# Altium schematic sheet BRZ_BATT_MGR.SchDoc
size B; SheetNumber: 1; SheetTotal: 9
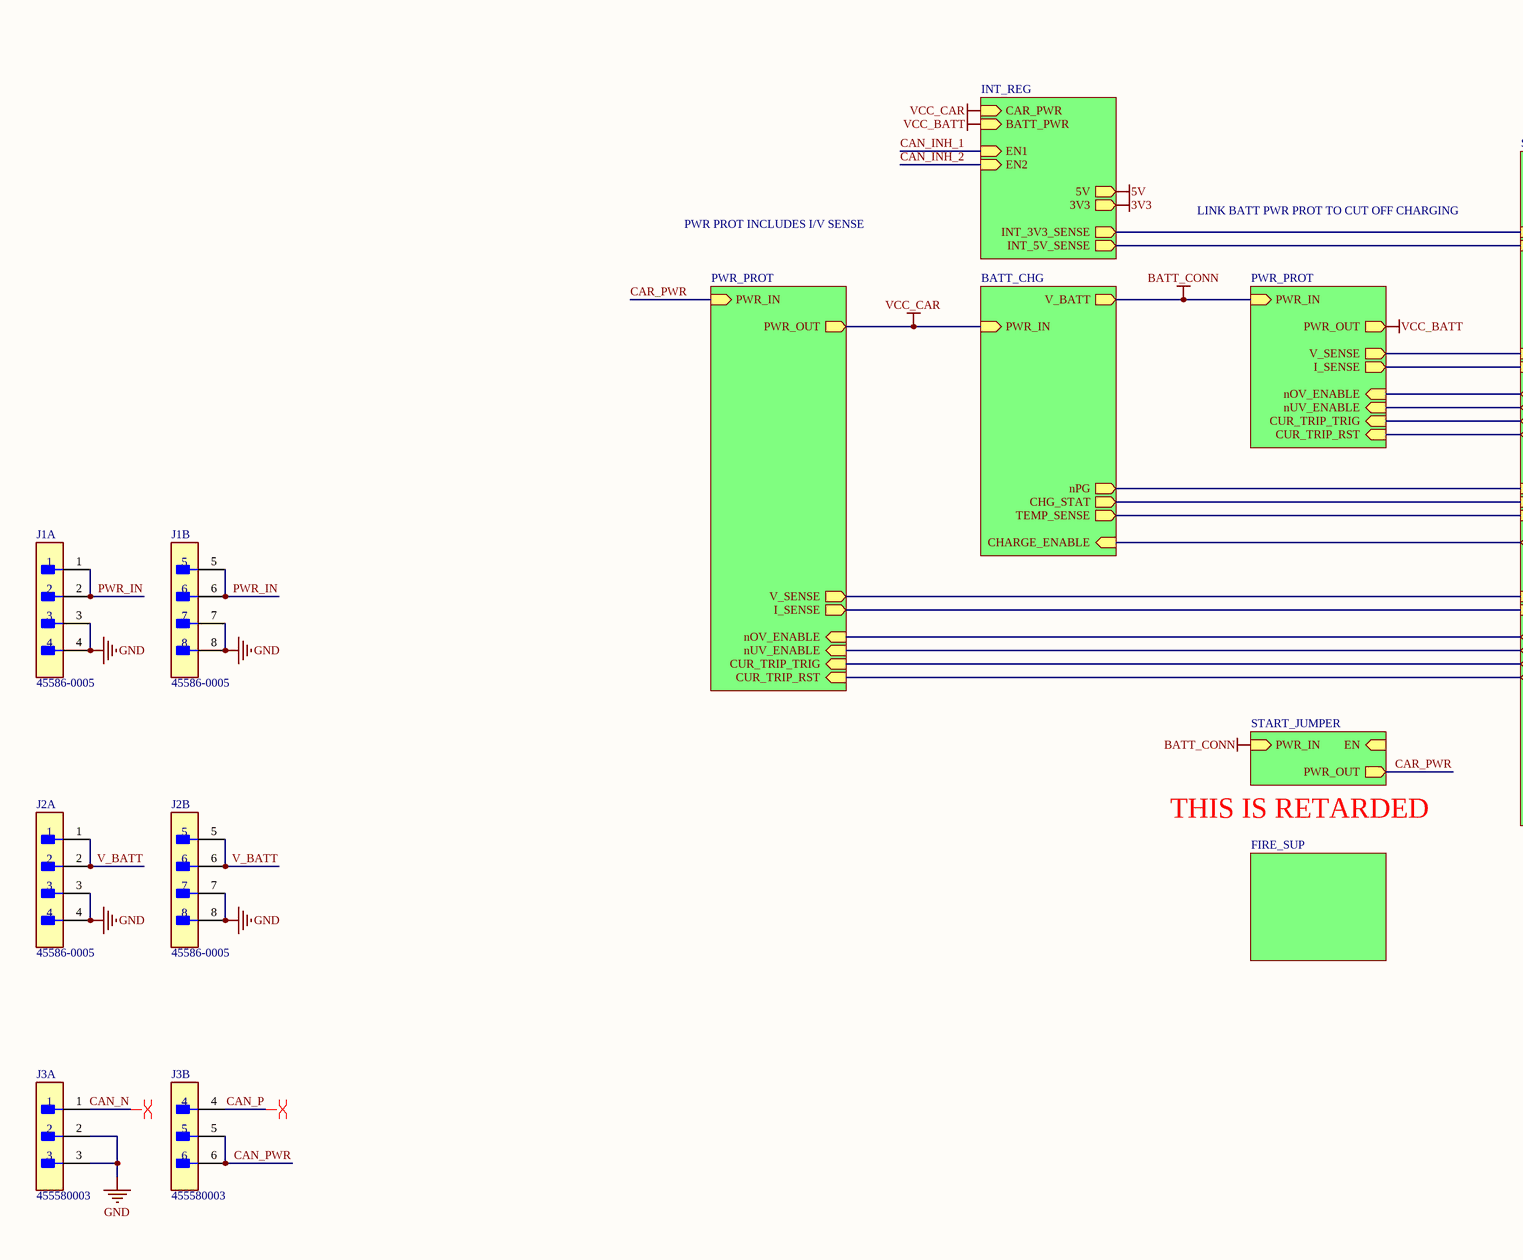
[diagram p0: BRZ_BATT_MGR.SchDoc, left]
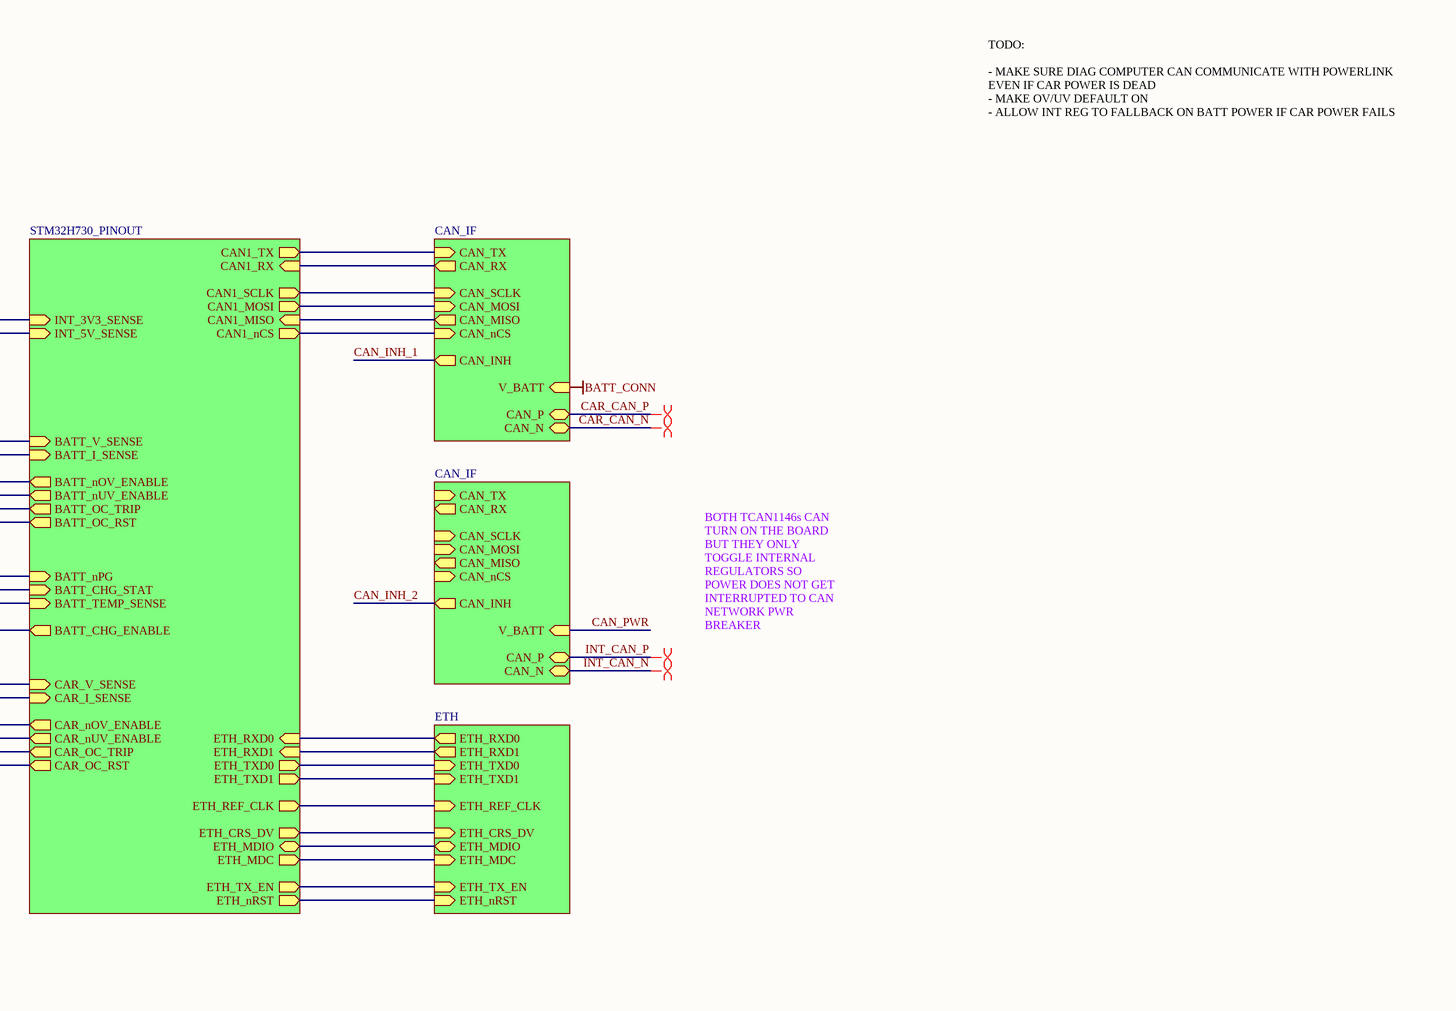
[diagram p1: BRZ_BATT_MGR.SchDoc, right]

## Parts
J1  45586-0005  [FP-45586-0005-MFG]  (parts A,B of 2)
J2  45586-0005  [FP-45586-0005-MFG]  (parts A,B of 2)
J3  455580003  [FP-455580003-MFG]  (parts A,B of 2)

## Sub-sheets
BATT_CHG = BATT_CHG: PWR_IN (in), V_BATT (out), nPG (out), CHG_STAT (out), TEMP_SENSE (out), CHARGE_ENABLE (in)
CAN_IF_0 = CAN_IF: CAN_TX (in), CAN_RX (out), CAN_SCLK (in), CAN_MISO (out), CAN_MOSI (in), CAN_nCS (in), V_BATT (in), CAN_INH (out), CAN_P (bidir), CAN_N (bidir)
CAN_IF_1 = CAN_IF: CAN_TX (in), CAN_RX (out), CAN_SCLK (in), CAN_MISO (out), CAN_MOSI (in), CAN_nCS (in), CAN_P (bidir), CAN_N (bidir), V_BATT (in), CAN_INH (out)
ETH_0 = ETH: ETH_RXD0 (out), ETH_RXD1 (out), ETH_TXD0 (in), ETH_TXD1 (in), ETH_REF_CLK (in), ETH_CRS_DV (in), ETH_MDIO (bidir), ETH_MDC (in), ETH_nRST (in), ETH_TX_EN (in)
FIRE_SUP = FIRE_SUP: no entries
INT_REG = INT_REG: INT_3V3_SENSE (out), INT_5V_SENSE (out), 5V (out), 3V3 (out), EN1 (in), EN2 (in), CAR_PWR (in), BATT_PWR (in)
MCU = STM32H730_PINOUT: INT_3V3_SENSE (in), INT_5V_SENSE (in), BATT_V_SENSE (in), BATT_I_SENSE (in), BATT_nOV_ENABLE (out), BATT_nUV_ENABLE (out), BATT_OC_TRIP (out), BATT_OC_RST (out), BATT_nPG (in), BATT_CHG_STAT (in), BATT_TEMP_SENSE (in), BATT_CHG_ENABLE (out), CAR_V_SENSE (in), CAR_I_SENSE (in), CAR_nOV_ENABLE (out), CAR_nUV_ENABLE (out), CAR_OC_TRIP (out), CAR_OC_RST (out), CAN1_TX (out), CAN1_RX (in), CAN1_SCLK (out), CAN1_MOSI (out), CAN1_MISO (in), CAN1_nCS (out), ETH_TX_EN (out), ETH_nRST (out), ETH_MDC (out), ETH_MDIO (bidir), ETH_CRS_DV (out), ETH_REF_CLK (out), ETH_RXD1 (in), ETH_TXD0 (out), ETH_TXD1 (out), ETH_RXD0 (in)
PWR_PROT_0 = PWR_PROT: PWR_OUT (out), PWR_IN (in), V_SENSE (out), I_SENSE (out), CUR_TRIP_RST (in), CUR_TRIP_TRIG (in), nOV_ENABLE (in), nUV_ENABLE (in)
PWR_PROT_2 = PWR_PROT: PWR_OUT (out), PWR_IN (in), V_SENSE (out), I_SENSE (out), CUR_TRIP_TRIG (in), CUR_TRIP_RST (in), nOV_ENABLE (in), nUV_ENABLE (in)
START_JUMPER = START_JUMPER: PWR_IN (in), PWR_OUT (out), EN (in)

## Nets
3V3: sheet INT_REG/3V3
5V: sheet INT_REG/5V
BATT_CONN: sheet BATT_CHG/V_BATT, sheet PWR_PROT_2/PWR_IN, sheet CAN_IF_0/V_BATT, sheet START_JUMPER/PWR_IN
GND: J1.3 J1.4 J1.7 J1.8 J2.3 J2.4 J2.7 J2.8 J3.2 J3.3
VCC_BATT: sheet INT_REG/BATT_PWR, sheet PWR_PROT_2/PWR_OUT
VCC_CAR: sheet PWR_PROT_0/PWR_OUT, sheet INT_REG/CAR_PWR, sheet BATT_CHG/PWR_IN
CAN_INH_1: sheet INT_REG/EN1, sheet CAN_IF_0/CAN_INH
CAN_INH_2: sheet INT_REG/EN2, sheet CAN_IF_1/CAN_INH
CAN_N: J3.1
CAN_P: J3.4
CAN_PWR: J3.5 J3.6 ; sheet CAN_IF_1/V_BATT
CAR_CAN_N: sheet CAN_IF_0/CAN_N
CAR_CAN_P: sheet CAN_IF_0/CAN_P
CAR_PWR: sheet PWR_PROT_0/PWR_IN, sheet START_JUMPER/PWR_OUT
INT_CAN_N: sheet CAN_IF_1/CAN_N
INT_CAN_P: sheet CAN_IF_1/CAN_P
PWR_IN: J1.1 J1.2 J1.5 J1.6
V_BATT: J2.1 J2.2 J2.5 J2.6
(unnamed): sheet PWR_PROT_0/V_SENSE, sheet MCU/CAR_V_SENSE
(unnamed): sheet PWR_PROT_0/I_SENSE, sheet MCU/CAR_I_SENSE
(unnamed): sheet PWR_PROT_0/CUR_TRIP_RST, sheet MCU/CAR_OC_RST
(unnamed): sheet PWR_PROT_0/CUR_TRIP_TRIG, sheet MCU/CAR_OC_TRIP
(unnamed): sheet PWR_PROT_0/nOV_ENABLE, sheet MCU/CAR_nOV_ENABLE
(unnamed): sheet PWR_PROT_0/nUV_ENABLE, sheet MCU/CAR_nUV_ENABLE
(unnamed): sheet INT_REG/INT_3V3_SENSE, sheet MCU/INT_3V3_SENSE
(unnamed): sheet INT_REG/INT_5V_SENSE, sheet MCU/INT_5V_SENSE
(unnamed): sheet BATT_CHG/nPG, sheet MCU/BATT_nPG
(unnamed): sheet BATT_CHG/CHG_STAT, sheet MCU/BATT_CHG_STAT
(unnamed): sheet BATT_CHG/TEMP_SENSE, sheet MCU/BATT_TEMP_SENSE
(unnamed): sheet BATT_CHG/CHARGE_ENABLE, sheet MCU/BATT_CHG_ENABLE
(unnamed): sheet MCU/BATT_V_SENSE, sheet PWR_PROT_2/V_SENSE
(unnamed): sheet MCU/BATT_I_SENSE, sheet PWR_PROT_2/I_SENSE
(unnamed): sheet MCU/BATT_nOV_ENABLE, sheet PWR_PROT_2/nOV_ENABLE
(unnamed): sheet MCU/BATT_nUV_ENABLE, sheet PWR_PROT_2/nUV_ENABLE
(unnamed): sheet MCU/BATT_OC_TRIP, sheet PWR_PROT_2/CUR_TRIP_TRIG
(unnamed): sheet MCU/BATT_OC_RST, sheet PWR_PROT_2/CUR_TRIP_RST
(unnamed): sheet MCU/CAN1_TX, sheet CAN_IF_0/CAN_TX
(unnamed): sheet MCU/CAN1_RX, sheet CAN_IF_0/CAN_RX
(unnamed): sheet MCU/CAN1_SCLK, sheet CAN_IF_0/CAN_SCLK
(unnamed): sheet MCU/CAN1_MOSI, sheet CAN_IF_0/CAN_MOSI
(unnamed): sheet MCU/CAN1_MISO, sheet CAN_IF_0/CAN_MISO
(unnamed): sheet MCU/CAN1_nCS, sheet CAN_IF_0/CAN_nCS
(unnamed): sheet MCU/ETH_TX_EN, sheet ETH_0/ETH_TX_EN
(unnamed): sheet MCU/ETH_nRST, sheet ETH_0/ETH_nRST
(unnamed): sheet MCU/ETH_MDC, sheet ETH_0/ETH_MDC
(unnamed): sheet MCU/ETH_MDIO, sheet ETH_0/ETH_MDIO
(unnamed): sheet MCU/ETH_CRS_DV, sheet ETH_0/ETH_CRS_DV
(unnamed): sheet MCU/ETH_REF_CLK, sheet ETH_0/ETH_REF_CLK
(unnamed): sheet MCU/ETH_RXD1, sheet ETH_0/ETH_RXD1
(unnamed): sheet MCU/ETH_TXD0, sheet ETH_0/ETH_TXD0
(unnamed): sheet MCU/ETH_TXD1, sheet ETH_0/ETH_TXD1
(unnamed): sheet MCU/ETH_RXD0, sheet ETH_0/ETH_RXD0

## Layout directives
differential pair: CAN_N, CAN_P, CAR_CAN_N, CAR_CAN_P, INT_CAN_N, INT_CAN_P

## Notes on the sheet
- PWR PROT INCLUDES I/V SENSE
- LINK BATT PWR PROT TO CUT OFF CHARGING
- TODO:
  - MAKE SURE DIAG COMPUTER CAN COMMUNICATE WITH POWERLINK EVEN IF CAR POWER IS DEAD
  - MAKE OV/UV DEFAULT ON
  - ALLOW INT REG TO FALLBACK ON BATT POWER IF CAR POWER FAILS
- BOTH TCAN1146s CAN TURN ON THE BOARD BUT THEY ONLY TOGGLE INTERNAL REGULATORS SO POWER DOES NOT GET INTERRUPTED TO CAN NETWORK PWR BREAKER
- THIS IS RETARDED

## Library data of the parts
J1 J2 = CMP-04776-000690-1: CONN HEADER R/A 8POS 4.2MM
J3 = CMP-04776-000024-1: CONN HEADER R/A 6POS 4.2MM; Manufacturer: Molex; Standoff Height: 0.4mm; Conn Orientation: Right Angle; Number Of Contacts: 6; Conn Gender: Male; Voltage Rating: 600V; Current Rating: 8A; Footprint Url: https://www.molex.com/pdm_docs/sd/455580003_sd.pdf; Number Of Rows: 2; Lead Free: Yes; Digikey Description: CONN HEADER R/A 6POS 4.2MM; ComponentLink2URL: https://www.molex.com/webdocs/datasheets/pdf/en-us/0455580003_PCB_HEADERS.pdf; Octopart: https://octopart.com/45558-0003-molex-7672845; Package: 0; Device Class L3: unset; ComponentLink2Description: Datasheet; Device Class L2: Headers and Wire Housings; Category: Conn; Contact Material: Tin,Nickel; Mouser Description: Conn Power HDR 6 POS 4.2mm Solder ST Thru-Hole 6 Terminal 1 Port Mini-Fit Jr™ Tray; Manufacturer Part Number: 455580003; Pitch: 4.2mm; Device Class L1: Connectors; Temperature Range Low: -40°C; Temperature: -40°C to +105°C; RoHS: TRUE; Temperature Range High: +105°C; Height: 10.38mm; Automotive: No